# Altium schematic sheet altium.schdoc
size 193 x 133 mm
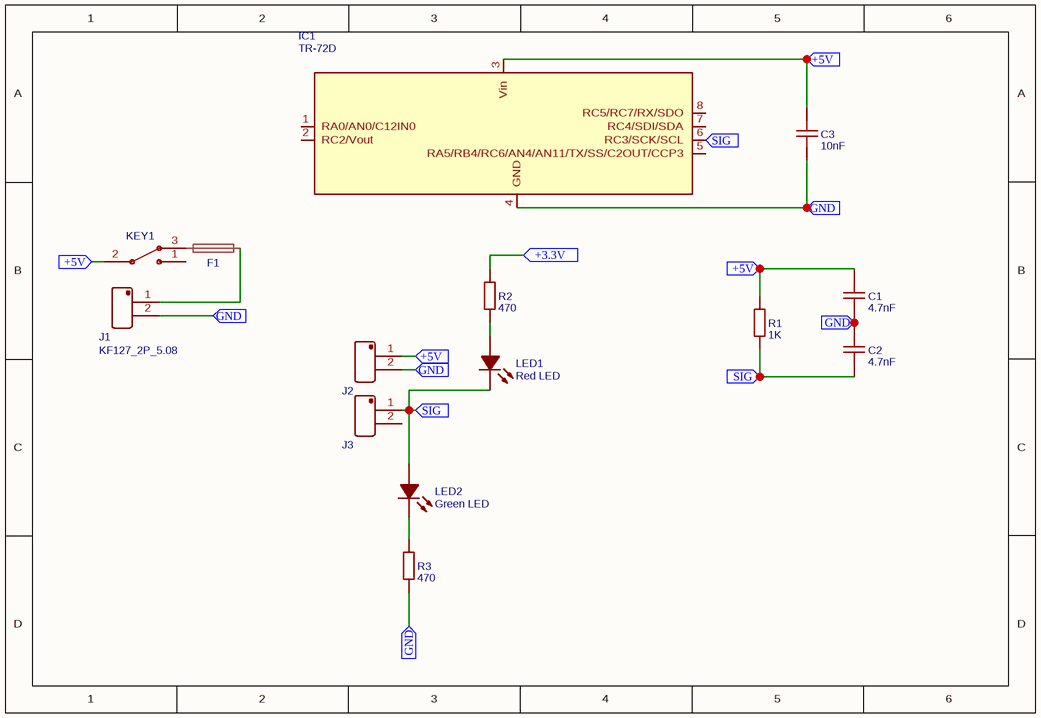
[diagram p0: altium.schdoc]

## Parts
C1  4.7nF  [0805]
C2  4.7nF  [0805]
C3  10nF  [0603]
F1  NO  [OMF_125]  (value not drawn)
IC1  TR-72D  [IQRF_KON-SIM-01]
J1  KF127_2P_5.08  [KF127_2P_5.08]
J2  KF127_2P_5.08  [KF127_2P_5.08]  (value not drawn)
J3  KF127_2P_5.08  [KF127_2P_5.08]  (value not drawn)
KEY1  MSK-11027 Toggle Switches  [MSK-11027]  (value not drawn)
LED1  Red LED  [LED-SMD_L3.5-W2.8-R-RD]
LED2  Green LED  [LED-SMD_L3.5-W2.8-R-RD]
R1  1K  [0805]
R2  470  [0805]
R3  470  [0805]

## Ports
+3.3V, +5V, GND, SIG

## Nets
+3.3V: R2.2 ; port +3.3V
+5V: C1.2 C3.2 IC1.3(Vin) J2.1(PIN1) KEY1.2 R1.2 ; port +5V
GND: C1.1 C2.2 C3.1 IC1.4(GND) J1.2(PIN2) J2.2(PIN2) R3.1 ; port GND
SIG: C2.1 IC1.6(RC3/SCK/SCL) J3.1(PIN1) LED1.2(K) LED2.1(A) R1.1 ; port SIG
NetF1_1: F1.1 KEY1.3
NetF1_2: F1.2 J1.1(PIN1)
NetLED1_1: LED1.1(A) R2.1
NetLED2_2: LED2.2(K) R3.2

Not connected (* = marked no-connect by the designer): IC1 1(RA0/AN0/C12IN0) 2(RC2/Vout) 5(RA5/RB4/RC6/AN4/AN11/TX/SS/C2OUT/CCP3) 7(RC4/SDI/SDA) 8(RC5/RC7/RX/SDO); J3 2(PIN2); KEY1 1

## Library data of the parts
C1 C2 = 4.7nF: BOM_Manufacturer: WTC; BOM_Manufacturer Part: 0805B472K201; nameAlias: Capacitance; BOM_Supplier: LCSC; BOM_Supplier Part: C77474; spicePre: C; spiceSymbolName: 0805B472K201
C3 = 10nF: BOM_Manufacturer: Guangdong Fenghua Advanced Tech; BOM_Manufacturer Part: 0603B103K500AT; nameAlias: Capacitance; Contributor: LCSC; BOM_Supplier: LCSC; BOM_Supplier Part: C327421; spicePre: C; spiceSymbolName: 0603B103K500AT
F1 = NO: BOM_Manufacturer Part: 3403.0015.11; Contributor: romiksm; BOM_Supplier: Mouser; BOM_Supplier Part: 693-3403.0015.11; link: https://www.mouser.co.uk/ProductDetail/Schurter/3403001511?qs=sGAEpiMZZMtxU2g%2f1juGqdRmCQF0%252bT4VUkZkHB0fJk4%3d; spicePre: F
IC1 = TR-72D: Contributor: Simen Stensas; license: https://www.gnu.org/licenses/lgpl-2.1.html; spicePre: I
J1-J3 = KF127_2P_5.08: BOM_Manufacturer: Kefa Electronics; BOM_Manufacturer Part: KF127L-5.08; Contributor: GrahamG; spicePre: J
KEY1 = MSK-11027 Toggle Switches: BOM_Manufacturer: ReliaPro; BOM_Supplier Part: C21381; BOM_Supplier: LCSC; BOM_Manufacturer Part: MSK-11027 Toggle Switches; image: http://image.lceda.cn/szlcsc/C21381.jpg; spicePre: K
LED1 = Red LED: BOM_Manufacturer: KENTO; BOM_Manufacturer Part: 3528 Red LED; SMT Type: Extend; BOM_Supplier: LCSC; image: //image.lceda.cn/szlcsc/C2305.jpg; BOM_Supplier Part: C2305; BOM_LCSC Assembly: Yes; spicePre: L
LED2 = Green LED: BOM_Manufacturer: KENTO; BOM_Manufacturer Part: 3528 Red LED; SMT Type: Extend; BOM_Supplier: LCSC; image: //image.lceda.cn/szlcsc/C2305.jpg; BOM_Supplier Part: C2305; BOM_LCSC Assembly: Yes; spicePre: L
R1 = 1K: BOM_Manufacturer: LIZ Elec; BOM_Manufacturer Part: CR0805J80102G; nameAlias: Resistance (Ohms); Contributor: LCSC; BOM_Supplier: LCSC; BOM_Supplier Part: C101925; spicePre: R; spiceSymbolName: CR0805J80102G
R2 R3 = 470: BOM_Manufacturer: LIZ Elec; BOM_Manufacturer Part: CR0805J80102G; nameAlias: Resistance (Ohms); Contributor: LCSC; BOM_Supplier: LCSC; BOM_Supplier Part: C101925; spicePre: R; spiceSymbolName: CR0805J80102G